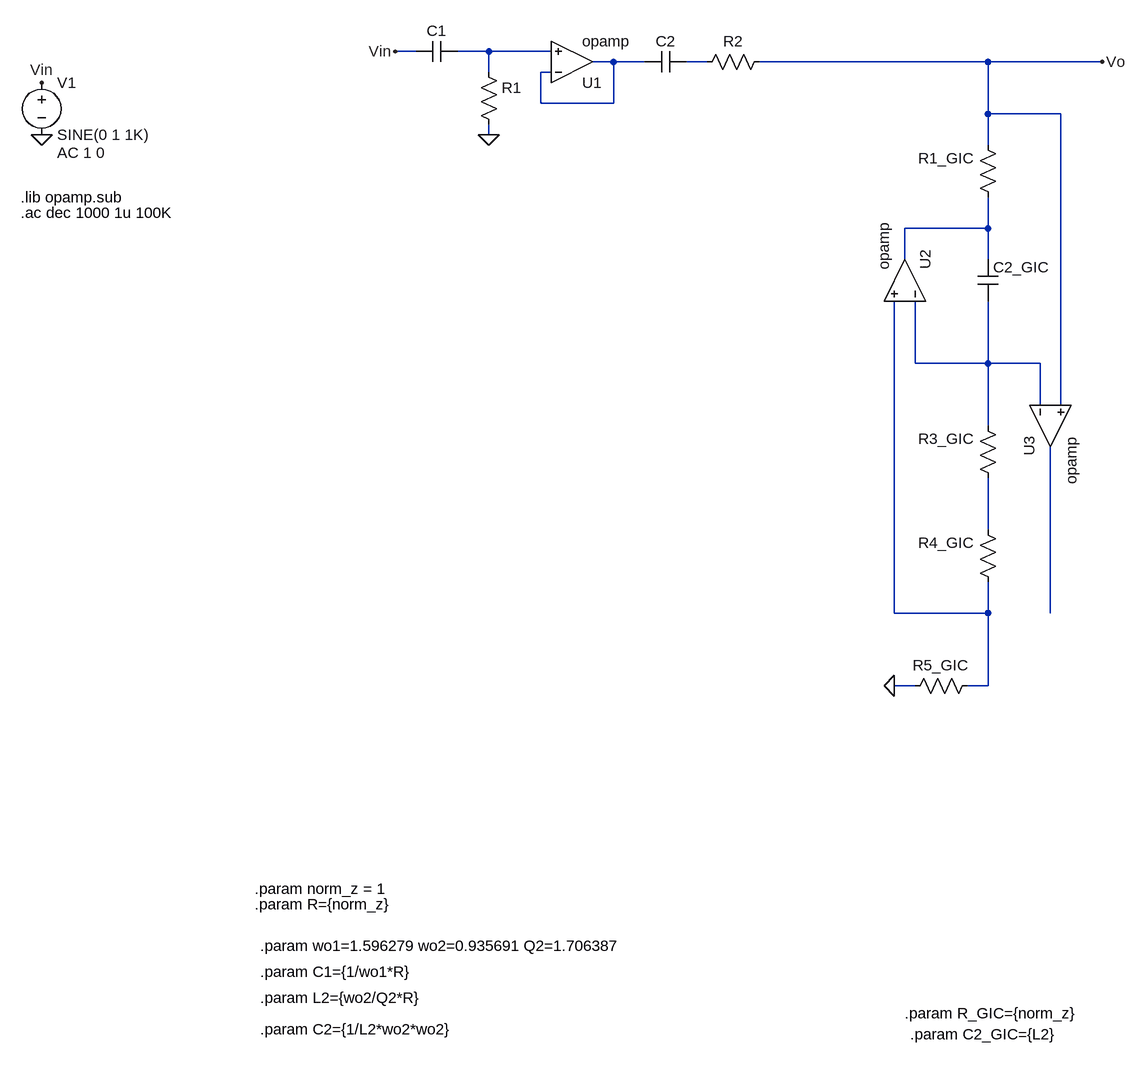
[diagram p0: schematic HPF_normalizado_con_GIC_sinvalores.asc]
HPF_normalizado_con_GIC_sinvalores.asc, the LTspice schematic file:
Version 4.1
SHEET 1 2160 1640
WIRE 80 112 48 112
WIRE 192 112 144 112
WIRE 288 112 192 112
WIRE 384 128 352 128
WIRE 432 128 384 128
WIRE 528 128 496 128
WIRE 960 128 608 128
WIRE 1136 128 960 128
WIRE 192 144 192 112
WIRE 288 144 272 144
WIRE 272 192 272 144
WIRE 384 192 384 128
WIRE 384 192 272 192
WIRE 960 208 960 128
WIRE 1072 208 960 208
WIRE 192 240 192 224
WIRE 960 256 960 208
WIRE 960 384 960 336
WIRE 960 384 832 384
WIRE 832 432 832 384
WIRE 960 432 960 384
WIRE 848 592 848 496
WIRE 960 592 960 496
WIRE 960 592 848 592
WIRE 1040 592 960 592
WIRE 1040 656 1040 592
WIRE 1072 656 1072 208
WIRE 960 688 960 592
WIRE 960 848 960 768
WIRE 816 976 816 496
WIRE 960 976 960 928
WIRE 960 976 816 976
WIRE 1056 976 1056 720
WIRE 848 1088 816 1088
WIRE 960 1088 960 976
WIRE 960 1088 928 1088
FLAG 192 240 0
FLAG 48 112 Vin
FLAG -496 240 0
FLAG -496 160 Vin
FLAG 816 1088 0
FLAG 1136 128 Vo
SYMBOL res 176 128 R0
SYMATTR InstName R1
SYMATTR Value ""
SYMBOL cap 144 96 R90
WINDOW 0 0 32 VBottom 2
WINDOW 3 32 32 VTop 2
SYMATTR InstName C1
SYMATTR Value ""
SYMBOL OpAmps\\opamp 320 192 M180
SYMATTR InstName U1
SYMBOL cap 496 112 R90
WINDOW 0 0 32 VBottom 2
WINDOW 3 32 32 VTop 2
SYMATTR InstName C2
SYMATTR Value ""
SYMBOL res 624 112 R90
WINDOW 0 0 56 VBottom 2
WINDOW 3 32 56 VTop 2
SYMATTR InstName R2
SYMATTR Value ""
SYMBOL voltage -496 144 R0
WINDOW 123 24 124 Left 2
WINDOW 39 0 0 Left 0
SYMATTR Value2 AC 1 0
SYMATTR InstName V1
SYMATTR Value SINE(0 1 1K)
SYMBOL res 976 352 R180
WINDOW 0 36 76 Left 2
WINDOW 3 36 40 Left 2
SYMATTR InstName R1_GIC
SYMATTR Value ""
SYMBOL cap 976 496 R180
WINDOW 0 -79 52 Left 2
WINDOW 3 -100 4 Left 2
SYMATTR InstName C2_GIC
SYMATTR Value ""
SYMBOL OpAmps\\opamp 896 464 M270
SYMATTR InstName U2
SYMBOL OpAmps\\opamp 992 688 M90
SYMATTR InstName U3
SYMBOL res 976 784 R180
WINDOW 0 36 76 Left 2
WINDOW 3 36 40 Left 2
SYMATTR InstName R3_GIC
SYMATTR Value ""
SYMBOL res 976 944 R180
WINDOW 0 36 76 Left 2
WINDOW 3 36 40 Left 2
SYMATTR InstName R4_GIC
SYMATTR Value ""
SYMBOL res 944 1072 R90
WINDOW 0 0 56 VBottom 2
WINDOW 3 32 56 VTop 2
SYMATTR InstName R5_GIC
SYMATTR Value ""
TEXT -528 360 Left 2 !.ac dec 1000 1u 100K
TEXT -528 336 Left 2 !.lib opamp.sub
TEXT -168 1400 Left 2 !.param norm_z = 1
TEXT -168 1424 Left 2 !.param R={norm_z}
TEXT -160 1488 Left 2 !.param wo1=1.596279 wo2=0.935691 Q2=1.706387
TEXT -160 1528 Left 2 !.param C1={1/wo1*R}
TEXT -160 1568 Left 2 !.param L2={wo2/Q2*R}
TEXT -160 1616 Left 2 !.param C2={1/L2*wo2*wo2}
TEXT 832 1592 Left 2 !.param R_GIC={norm_z}
TEXT 840 1624 Left 2 !.param C2_GIC={L2}

The netlist it stands for:
* HPF_normalizado_con_GIC_sinvalores.asc
R1 N001 0
C1 N001 Vin
X§U1 N002 N001 N002 opamp Aol=100K GBW=10Meg  ; pins invin noninvin out
C2 N003 N002
R2 Vo N003
V1 Vin 0 SINE(0 1 1K) AC 1 0
R1_GIC N004 Vo
C2_GIC N005 N004
X§U2 N005 N007 N004 opamp Aol=100K GBW=10Meg  ; pins invin noninvin out
X§U3 N005 Vo N008 opamp Aol=100K GBW=10Meg  ; pins invin noninvin out
R3_GIC N006 N005
R4_GIC N007 N006
R5_GIC N007 0
.ac dec 1000 1u 100K
.lib opamp.sub
.param norm_z = 1
.param R={norm_z}
.param wo1=1.596279 wo2=0.935691 Q2=1.706387
.param C1={1/wo1*R}
.param L2={wo2/Q2*R}
.param C2={1/L2*wo2*wo2}
.param R_GIC={norm_z}
.param C2_GIC={L2}
.backanno
.end